# EAGLE design CARDUINO_32U4 (EAGLE 6.4)
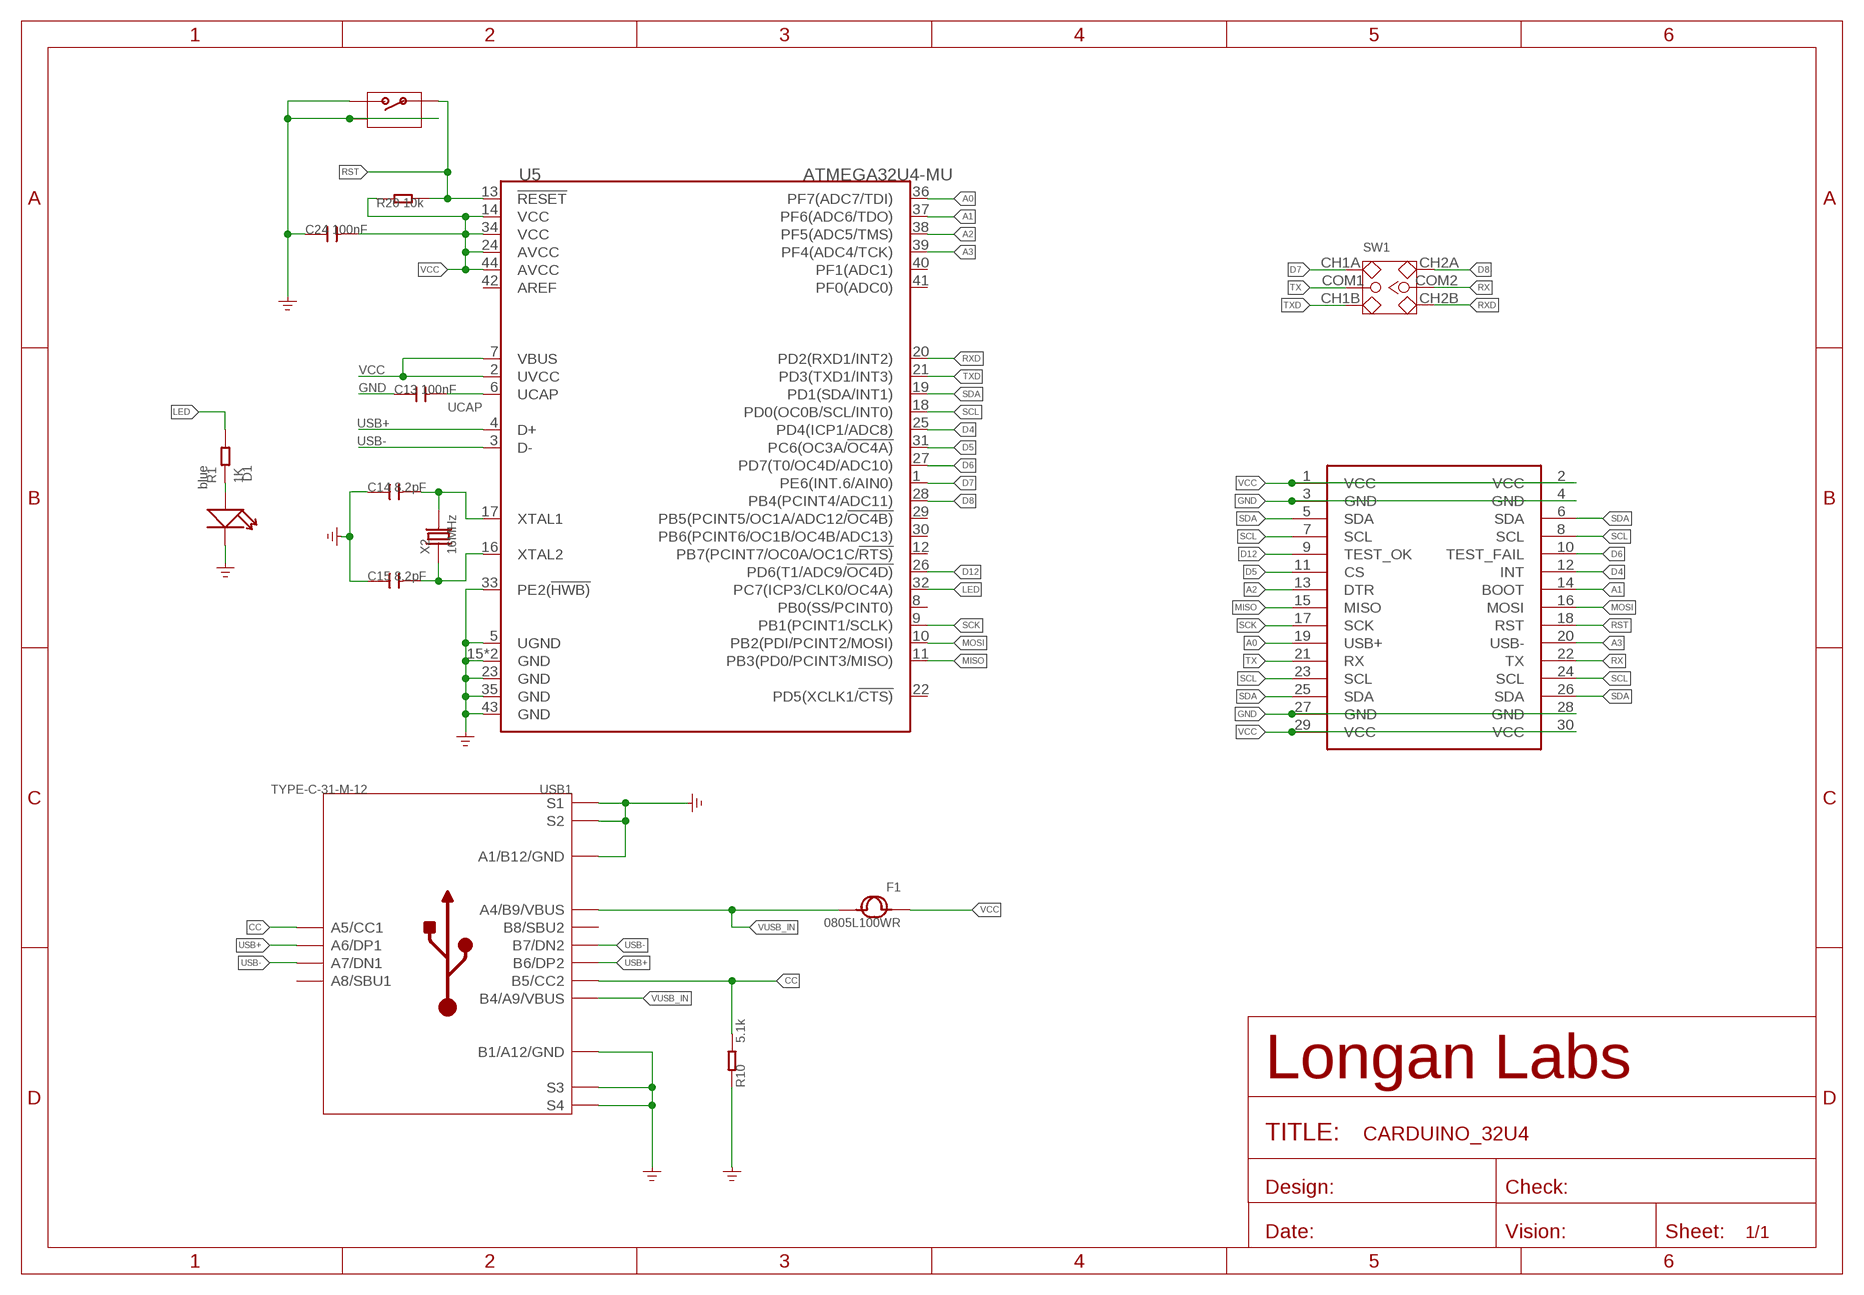
[diagram p0: schematic, sheet 1]

## Parts
C13  100nF  C-0603  [C0603]
C14  8.2pF  C-0603  [C0603]
C15  8.2pF  C-0603  [C0603]
C24  100nF  C-0603  [C0603]
D1  blue  LED'0603'  [LED-0603]
F1  0805L100WR  FUSE0805  [F0805]
MOUDLE1  MOUDLE-2X15P-2.54'BOARD'  [MOUDLE-2X15P-2.54]
R1  1K  RES-0603  [R0603]
R10  5.1k  RES-0603  [R0603]
R20  10k  R-0603  [R0603]
RESET  BUTTON-4P-REINFORCE  BUTTON-4P-REINFORCE'TS-1188E'  [4P-SMD-7X3.5X3.5H]
SW1  SWITCH-2CH-6P  [SW6-2.5-SMD-9.2X3.5X3.5MM]
U5  ATMEGA32U4-MU  [QFN44]
USB1  TYPE-C-31-M-12  USB2.0-TYPE-C  [USB2.0-TYPE-C]
X2  16MHz  CRYSTAL'5032'  [2P-SMD-5X3.2]

## Nets
A0: MOUDLE1.19(USB+) U5.36(PF7(ADC7/TDI))
A1: MOUDLE1.14(BOOT) U5.37(PF6(ADC6/TDO))
A2: MOUDLE1.13(DTR) U5.38(PF5(ADC5/TMS))
A3: MOUDLE1.20(USB-) U5.39(PF4(ADC4/TCK))
CC: R10.2 USB1.A5(A5/CC1) USB1.B5(B5/CC2)
D4: MOUDLE1.12(INT) U5.25(PD4(ICP1/ADC8))
D5: MOUDLE1.11(CS) U5.31(PC6(OC3A/!OC4A))
D6: MOUDLE1.10(TEST_FAIL) U5.27(PD7(T0/OC4D/ADC10))
D7: SW1.CH1A U5.1(PE6(INT.6/AIN0))
D8: SW1.CH2A U5.28(PB4(PCINT4/ADC11))
D12: MOUDLE1.9(TEST_OK) U5.26(PD6(T1/ADC9/!OC4D))
GND [none1]: C13.1 C14.1 C15.1 C24.1 D1.- MOUDLE1.3(GND) MOUDLE1.4(GND) MOUDLE1.27(GND) MOUDLE1.28(GND) R10.1 RESET.2 RESET.S1 RESET.S2 U5.5(UGND) U5.15(GND) U5.23(GND) U5.33(PE2(!HWB)) U5.35(GND) U5.43(GND) U5.TAB(GND) USB1.A1_B12(A1/B12/GND) USB1.B1_A12(B1/A12/GND) USB1.S1 USB1.S2 USB1.S3 USB1.S4 USB1.S5(S1) USB1.S6(S2)
LED: R1.2 U5.32(PC7(ICP3/CLK0/OC4A))
MISO: MOUDLE1.15(MISO) U5.11(PB3(PD0/PCINT3/MISO))
MOSI: MOUDLE1.16(MOSI) U5.10(PB2(PDI/PCINT2/MOSI))
N$1: D1.+ R1.1
N$6: C14.2 U5.17(XTAL1) X2.2
N$12: C15.2 U5.16(XTAL2) X2.1
RST: MOUDLE1.18(RST) R20.2 RESET.1 U5.13(!RESET)
RX: MOUDLE1.22(TX) SW1.COM2
RXD: SW1.CH2B U5.20(PD2(RXD1/INT2))
SCK: MOUDLE1.17(SCK) U5.9(PB1(PCINT1/SCLK))
SCL: MOUDLE1.7(SCL) MOUDLE1.8(SCL) MOUDLE1.23(SCL) MOUDLE1.24(SCL) U5.18(PD0(OC0B/SCL/INT0))
SDA: MOUDLE1.5(SDA) MOUDLE1.6(SDA) MOUDLE1.25(SDA) MOUDLE1.26(SDA) U5.19(PD1(SDA/INT1))
TX: MOUDLE1.21(RX) SW1.COM1
TXD: SW1.CH1B U5.21(PD3(TXD1/INT3))
UCAP: C13.2 U5.6(UCAP)
USB+: U5.4(D+) USB1.A6(A6/DP1) USB1.B6(B6/DP2)
USB-: U5.3(D-) USB1.A7(A7/DN1) USB1.B7(B7/DN2)
VCC: C24.2 F1.1 MOUDLE1.1(VCC) MOUDLE1.2(VCC) MOUDLE1.29(VCC) MOUDLE1.30(VCC) R20.1 U5.2(UVCC) U5.7(VBUS) U5.14(VCC) U5.24(AVCC) U5.34(VCC) U5.44(AVCC)
VUSB_IN: F1.2 USB1.A4_B9(A4/B9/VBUS) USB1.B4_A9(B4/A9/VBUS)
Unconnected: U5.8(PB0(SS/PCINT0)) U5.12(PB7(PCINT7/OC0A/OC1C/!RTS)) U5.22(PD5(XCLK1/!CTS)) U5.29(PB5(PCINT5/OC1A/ADC12/!OC4B)) U5.30(PB6(PCINT6/OC1B/OC4B/ADC13)) U5.40(PF1(ADC1)) U5.41(PF0(ADC0)) U5.42(AREF) USB1.A8(A8/SBU1) USB1.B8(B8/SBU2)

## Library data of the parts
C13-C15 C24 = Discrete:C*: Ceramic Capacitors
D1 = Discrete-new:LED
F1 = Discrete-small:FUSE
MOUDLE1 = Longan-moudle:MOUDLE-2X15P-2.54
R1 R10 = Discrete-new:RES
R20 = Discrete:R*
RESET = Discrete:BUTTON-4P-REINFORCE: TS-1188E http://www.best-dz.com/?thread-374-2.html
SW1 = LONGAN-DISCRETE:SWITCH-2CH-6P
U5 = IC:ATMEGA32U4: 8-bit Microcontroller With 16/32K Bytes of ISP Flash and USB controller
USB1 = Connector-new:USB2.0-TYPE-C
X2 = Discrete:CRYSTAL*: CRYSTAL

## Board
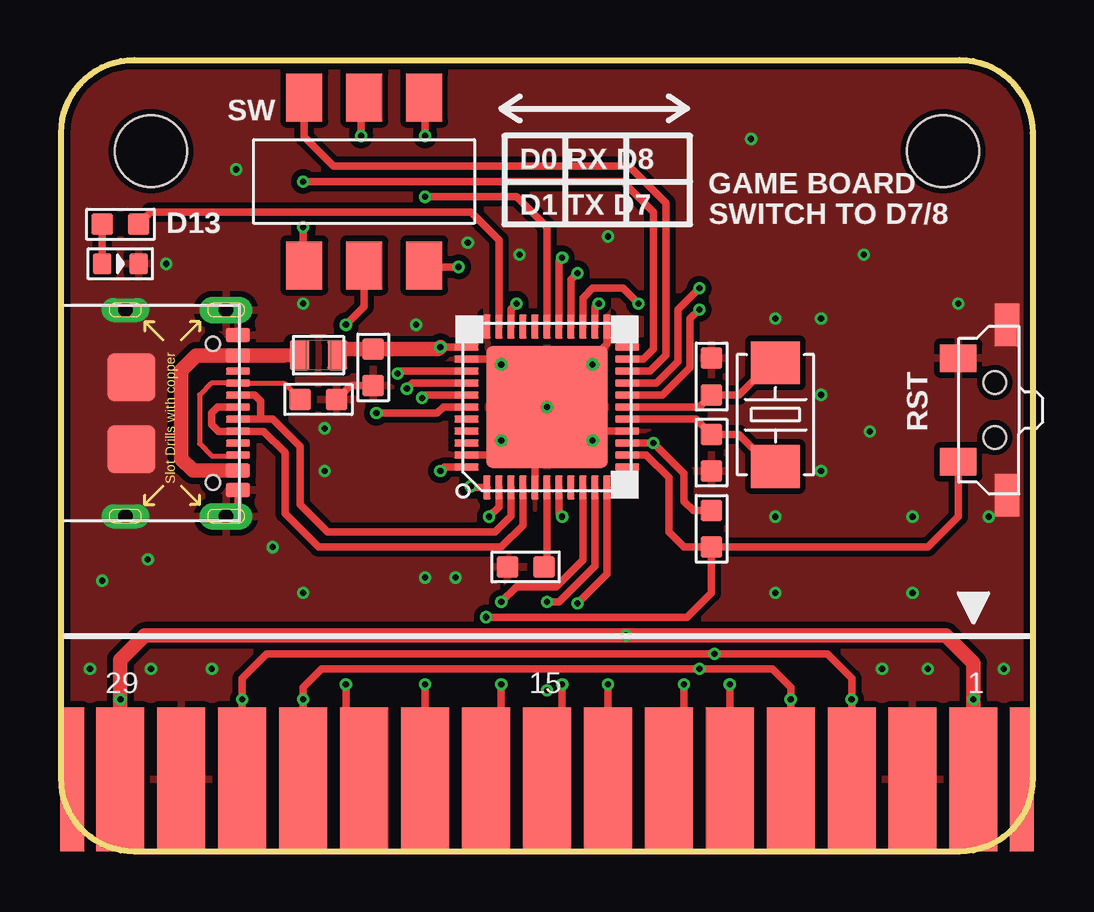
[diagram p1: board, top side]
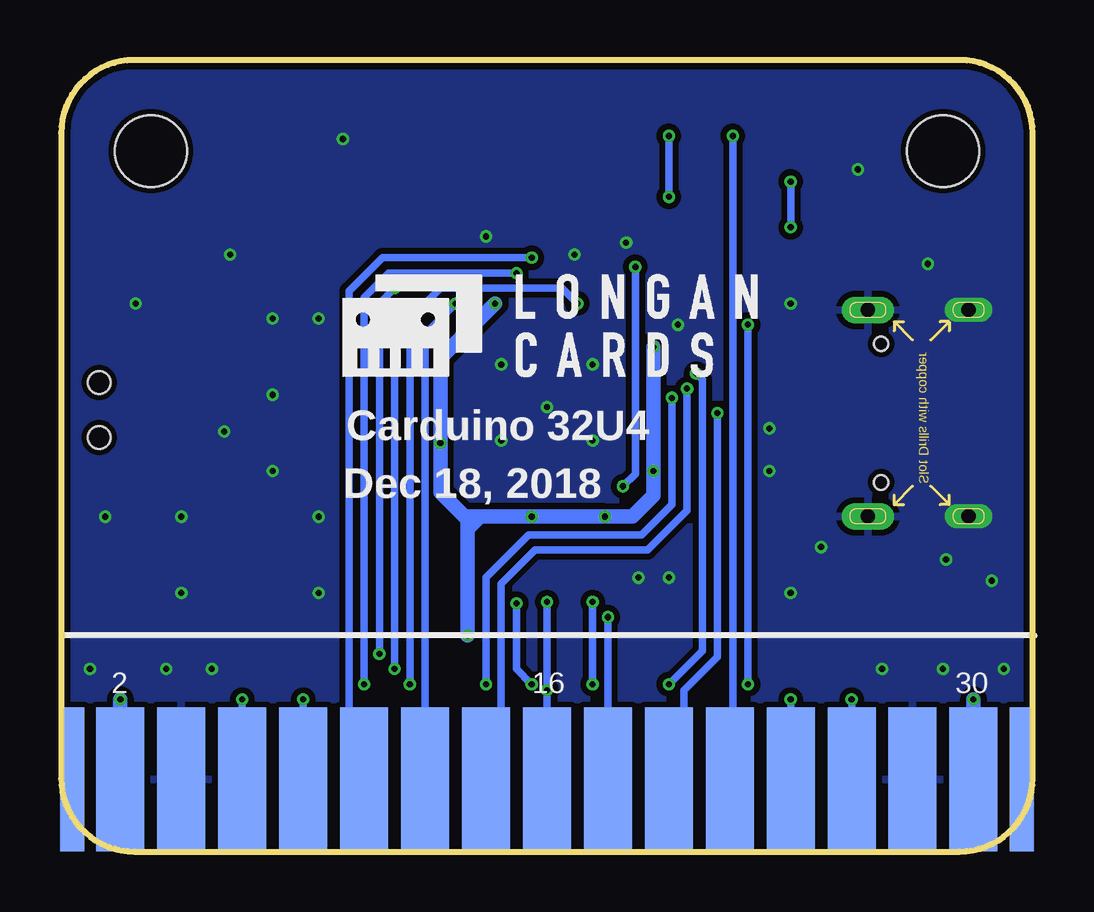
[diagram p2: board, bottom side, seen from below]

Size 40.5 x 33 mm. Coordinates in mm from the lower left corner, seen from the top.
Copper layers (1*16): Top 0.035mm / dielectric 1.5mm / Bottom 0.035mm
Design rules "SeeedStudio_2layer_DRU_no_angle_20140221": minimum track width 1mil, minimum drill 10mil, track to track 6mil, track to pad 6mil, pad to pad 6mil, via to via 6mil, smd to smd 0mil, copper to edge 10mil, drill to drill 10mil, minimum pad ring 4mil, minimum via ring 4mil, stop-mask expansion 2mil, vias tented up to drill 25mil, thermal gap 10mil

### Footprints (pad centres in the part's own frame; a part is rotated, then mirrored left to right if it is on the bottom)
C0603 = smd 0.889 x 0.889: 1 -0.762,0; 2 0.762,0
LED-0603 = smd 0.762 x 0.889: + -0.762,0; - 0.762,0
F0805 = smd 0.819 x 1.27: 1 -0.79,0; 2 0.79,0
MOUDLE-2X15P-2.54 = smd 2 x 6: 1 17.78,-13.492; 3 15.24,-13.492; 5 12.7,-13.492; 7 10.16,-13.492; 9 7.62,-13.492; 11 5.08,-13.492; 13 2.54,-13.492; 15 0,-13.492; 17 -2.54,-13.492; 19 -5.08,-13.492; 21 -7.62,-13.492; 23 -10.16,-13.492; 25 -12.7,-13.492; 27 -15.24,-13.492; 29 -17.78,-13.492 | smd 2 x 6 bottom: 2 17.78,-13.492; 4 15.24,-13.492; 6 12.7,-13.492; 8 10.16,-13.492; 10 7.62,-13.492; 12 5.08,-13.492; 14 2.54,-13.492; 16 0,-13.492; 18 -2.54,-13.492; 20 -5.08,-13.492; 22 -7.62,-13.492; 24 -10.16,-13.492; 26 -12.7,-13.492; 28 -15.24,-13.492; 30 -17.78,-13.492 | smd 1 x 6: P1 -19.8,-13.492; P4 19.8,-13.492 | smd 1 x 6 bottom: P2 -19.8,-13.492; P3 19.8,-13.492 | hole 3: -16.51,12.7; 16.51,12.7
R0603 = smd 0.889 x 0.889: 1 0,0.762; 2 0,-0.762
R0603' = smd 0.889 x 0.889: 1 -0.762,0; 2 0.762,0
4P-SMD-7X3.5X3.5H = smd 1.143 x 1.524: 1 -2.159,1.524; 2 2.159,1.524 | smd 1.778 x 1.016: S1 -3.556,-0.508; S2 3.556,-0.508 | hole 0.95: -1.15,0; 1.15,0
SW6-2.5-SMD-9.2X3.5X3.5MM = smd 1.5 x 2: CH1A -2.5,3.5; CH1B 2.5,3.5; CH2A -2.5,-3.5; CH2B 2.5,-3.5; COM1 0,3.5; COM2 0,-3.5
QFN44 = smd 1 x 0.3: 1 -3.35,2.5; 2 -3.35,2; 3 -3.35,1.5; 4 -3.35,1; 5 -3.35,0.5; 6 -3.35,0; 7 -3.35,-0.5; 8 -3.35,-1; 9 -3.35,-1.5; 10 -3.35,-2; 11 -3.35,-2.5; 23 3.35,-2.5; 24 3.35,-2; 25 3.35,-1.5; 26 3.35,-1; 27 3.35,-0.5; 28 3.35,0; 29 3.35,0.5; 30 3.35,1; 31 3.35,1.5; 32 3.35,2; 33 3.35,2.5 | smd 0.3 x 1: 12 -2.5,-3.35; 13 -2,-3.35; 14 -1.5,-3.35; 15 -1,-3.35; 16 -0.5,-3.35; 17 0,-3.35; 18 0.5,-3.35; 19 1,-3.35; 20 1.5,-3.35; 21 2,-3.35; 22 2.5,-3.35; 34 2.5,3.35; 35 2,3.35; 36 1.5,3.35; 37 1,3.35; 38 0.5,3.35; 39 0,3.35; 40 -0.5,3.35; 41 -1,3.35; 42 -1.5,3.35; 43 -2,3.35; 44 -2.5,3.35 | smd 5.08 x 5.08: TAB 0,0
USB2.0-TYPE-C = smd 1 x 0.6: A1_B12 -0.05,3.25; A4_B9 -0.05,2.4; B1_A12 -0.05,-3.2; B4_A9 -0.05,-2.4 | smd 1 x 0.3: A5 -0.05,1.25; A6 -0.05,0.25; A7 -0.05,-0.25; A8 -0.05,-1.25; B5 -0.05,-1.75; B6 -0.05,-0.75; B7 -0.05,0.75; B8 -0.05,1.75 | drill 0.6 pad 1 long: S1 -4.75,4.3; S2 -4.75,-4.3 | drill 0.6 pad 1.1 long: S3 -0.55,4.3; S4 -0.55,-4.3 | smd 2 x 2: S5 -4.5,1.5; S6 -4.5,-1.5 | hole 0.6: -1.1,-2.89; -1.1,2.89
2P-SMD-5X3.2 = smd 1.778 x 2.032: 1 -2.159,0; 2 2.159,0

### Placement (x,y rotation side)
C13  19.36,11.86 0 top
C14  27.11,19.8 270 top
C15  27.11,16.63 90 top
C24  13.01,20.18 90 top
D1  2.47,24.5 0 top
F1  10.72,20.69 180 top
MOUDLE1  20.25,16.5 0 top
R1  2.47,26.15 90 top
R10  10.72,18.85 270 top
R20  10k  [R0603']  27.11,13.45 270 top
RESET  38.92,18.41 90 top
SW1  12.63,27.93 180 top
U5  20.25,18.53 90 top
U$6  [LONGAN-CARDS-MIDDLE]  29.52,19.29 0 bottom
USB1  7.42,18.28 0 top
X2  29.77,18.21 90 top

### Tracks (layer width: path | path; a pad name or v marks a point on that pad's centre or on a via)
A0  (via drill 0.25 pad 0.51)
  Top 0.305: v15.17,6.97 MOUDLE1.19 | U5.36 14.18,20.03 v14.03,19.93
  Bottom 0.305: v15.17,6.97 13.77,8.37 13.77,19.68 v14.03,19.93
A1  (via drill 0.25 pad 0.51)
  Top 0.305: U5.37 14.65,19.53 v14.41,19.29
  Bottom 0.305: MOUDLE1.14 22.79,4.44 22.16,5.07 22.16,11.17 20.76,12.56 16.06,12.56 14.41,14.21 v14.41,19.29
A2  (via drill 0.25 pad 0.51)
  Top 0.305: U5.38 15.16,19.03 v15.04,18.91 | v22.79,6.97 MOUDLE1.13 22.79,2.4
  Bottom 0.305: v15.04,18.91 15.04,14.47 16.31,13.2 21.01,13.2 22.79,11.42 v22.79,6.97
A3  (via drill 0.25 pad 0.51)
  Top 0.305: U5.39 15.93,18.53 15.68,18.28 v13.14,18.28
  Bottom 0.305: MOUDLE1.20 14.54,3.64 14.54,6.72 13.14,8.12 v13.14,18.28
CC
  Top 0.203: USB1.B5 7.35,16.5 6.28,16.5 5.77,17.01 5.77,19.04 6.26,19.53 USB1.A5 9.28,19.53 R10.2
D4  (via drill 0.25 pad 0.51)
  Top 0.305: U5.25 21.75,23.08 22.16,23.48 23.43,23.48 v24.06,22.85
  Bottom 0.305: MOUDLE1.12 25.33,21.58 v24.06,22.85
D5  (via drill 0.25 pad 0.51)
  Top 0.305: MOUDLE1.11 25.33,3.55 25.96,4.18 v25.96,6.97 | U5.31 18.75,22.62 v18.98,22.85
  Bottom 0.305: v25.96,6.97 25.96,22.21 24.7,23.48 19.61,23.48 v18.98,22.85
D6  (via drill 0.25 pad 0.51)
  Top 0.305: U5.27 20.75,24.62 v20.89,24.76
  Bottom 0.305: MOUDLE1.10 28.51,3.64 28.51,23.36 27.11,24.76 v20.89,24.76
D7  (via drill 0.25 pad 0.51)
  Top 0.305: U5.1 17.12,15.18 v17.07,15.23 | v16.57,24.37 15.19,24.37 SW1.CH1A
  Bottom 0.305: v17.07,15.23 16.57,15.74 v16.57,24.37
D8  (via drill 0.25 pad 0.51)
  Top 0.305: U5.28 20.25,26.02 18.98,27.3 v15.17,27.3 | v15.17,29.84 15.17,31.39 SW1.CH2A
  Bottom 0.305: v15.17,27.3 v15.17,29.84
D12  (via drill 0.25 pad 0.51)
  Top 0.305: MOUDLE1.9 27.87,5.07 | 27.87,5.07 27.23,5.71 | v27.87,6.97 27.87,5.07 | U5.26 21.25,23.85 v21.52,24.12
  Bottom 0.305: v27.87,6.97 27.87,23.1 26.85,24.12 22.54,24.12 v21.52,24.12
GND  (via drill 0.25 pad 0.51)
  Top 0.305: U5.15 21.25,17.53 U5.TAB | U5.5 19.75,16.88 | 19.75,16.88 19.75,18.03 U5.TAB | U5.43 19.4,16.53 19.75,16.88 | U5.35 18.25,20.53 U5.TAB | U5.23 22.75,21.16 22.41,20.82 22.41,20.69 U5.TAB | USB1.B1_A12 7.37,14.48 USB1.S4 | C24.1 12.06,19.42 R10.1
  other vias: 20.25,18.53 3.74,7.61 6.28,7.61 1.2,7.61 34.22,7.61 36.12,7.61 39.3,7.61 29.77,13.96 31.68,15.87 31.68,19.04 31.68,22.21 29.77,22.21 33.71,17.52 35.49,13.96 29.77,10.79 35.49,10.79 37.39,22.85 18.34,20.31 22.16,20.31 22.16,17.14 18.34,17.14 4.38,24.5 14.79,21.96 7.3,28.44 3.61,12.18 8.82,12.69 10.09,10.79 16.44,11.42 15.17,11.42 1.71,11.29 33.46,24.88 38.66,13.96 10.09,22.85 10.98,15.87 16.95,25.39 10.98,17.64 28.76,29.71 19.11,24.88 22.79,25.64
  pour Top (isolate 0.254): -0.2,33.01 40.57,33.01 40.57,-0.01 -0.2,-0.01
  pour Bottom (isolate 0.254): -0.2,33.01 40.57,33.01 40.57,-0.01 -0.2,-0.01
LED
  Top 0.305: U5.32 18.25,25.48 17.07,26.66 3.74,26.66 R1.2
MISO  (via drill 0.25 pad 0.51)
  Top 0.305: MOUDLE1.15 20.89,3.64 v20.89,6.97 | U5.11 22.75,11.57 v21.52,10.34
  Bottom 0.305: v21.52,10.34 21.52,7.61 v20.89,6.97
MOSI  (via drill 0.25 pad 0.51)
  Top 0.305: U5.10 22.25,11.9 20.76,10.4 v20.25,10.4
  Bottom 0.305: MOUDLE1.16 v20.25,6.72 v20.25,10.4
N$1
  Top 0.305: D1.+ R1.1
N$6
  Top 0.305: U5.17 26.6,18.53 C14.2 28.25,19.04 29.27,20.06 29.46,20.06 X2.2
N$12
  Top 0.305: U5.16 26.46,18.03 C15.2 28.25,17.39 29.14,16.5 29.33,16.5 X2.1
RST  (via drill 0.25 pad 0.51)
  Top 0.305: 37.01,15.87 RESET.1 37.39,13.96 36.12,12.69 R20.2 | U5.13 24.39,16.53 25.33,15.59 25.33,13.32 25.96,12.69 R20.2 | v17.71,9.77 26.09,9.77 27.11,10.79 R20.2
  Bottom 0.305: MOUDLE1.18 v17.71,9.77
RX  (via drill 0.25 pad 0.51)
  Top 0.305: v12.5,29.84 12.5,31.3 SW1.COM2
  Bottom 0.305: MOUDLE1.22 12.63,5.45 12.5,5.58 v12.5,29.84
RXD
  Top 0.305: U5.20 24.54,20.03 25.2,20.69 25.2,27.04 23.68,28.56 11.36,28.56 10.13,29.8 SW1.CH2B
SCK  (via drill 0.25 pad 0.51)
  Top 0.305: U5.9 21.75,12.16 20.63,11.04 18.98,11.04 v18.34,10.4 | v18.34,6.97 18.34,3.64 MOUDLE1.17
  Bottom 0.305: v18.34,10.4 v18.34,6.97
SCL  (via drill 0.25 pad 0.51)
  Top 0.305: MOUDLE1.7 v30.41,6.34 30.41,6.85 29.65,7.61 v26.6,7.61 10.85,7.61 10.09,6.85 v10.09,6.34 MOUDLE1.24 | U5.18 25.07,19.03 26.22,20.18 26.22,22.21 v26.6,22.6
  Bottom 0.305: v10.09,6.34 MOUDLE1.24 | v30.41,6.34 MOUDLE1.7 | v26.6,7.61 v26.6,22.6
SDA  (via drill 0.25 pad 0.51)
  Top 0.305: MOUDLE1.26 v7.55,6.34 7.55,7.23 8.57,8.24 v27.23,8.24 31.93,8.24 32.95,7.23 v32.95,6.34 MOUDLE1.5 | U5.19 24.81,19.53 25.71,20.44 25.71,22.6 v26.6,23.48
  Bottom 0.305: MOUDLE1.26 v7.55,6.34 | v32.95,6.34 MOUDLE1.5 | v27.23,8.24 27.23,22.85 v26.6,23.48
TX  (via drill 0.25 pad 0.51)
  Top 0.305: MOUDLE1.21 12.63,5.07 11.99,5.71 11.87,5.71 v11.87,6.97 | v11.87,21.96 12.63,22.72 SW1.COM1
  Bottom 0.305: v11.87,6.97 v11.87,21.96
TXD  (via drill 0.25 pad 0.51)
  Top 0.305: U5.21 24.28,20.53 24.7,20.95 24.7,26.66 23.43,27.93 v10.09,27.93 | v10.09,26.02 10.09,24.47 SW1.CH1B
  Bottom 0.305: v10.09,27.93 v10.09,26.02
UCAP
  Top 0.305: U5.6 20.25,12.05 C13.2
USB+
  Top 0.305: U5.4 19.25,13.6 18.34,12.69 10.72,12.69 9.33,14.09 9.33,16.63 8.44,17.52 7.38,17.52 USB1.B6 7.36,17.52 6.56,17.52 6.28,17.8 6.28,18.28 6.53,18.53 USB1.A6
USB-
  Top 0.305: U5.3 18.75,13.98 18.09,13.32 11.11,13.32 9.96,14.47 9.96,16.88 8.82,18.02 8.31,18.02 | 8.31,18.02 USB1.A7 | USB1.B7 8.07,19.03 8.31,18.79 8.31,18.02
VCC  (via drill 0.25 pad 0.51)
  Top 0.305: U5.2 18.25,14.37 v17.84,13.96 | v24.7,17.03 24.8,17.03 | U5.34 v15.8,21.03 | U5.7 20.75,14.1 v20.89,13.96 | 14.07,21.03 C24.2 | U5.44 15.97,16.03 v15.8,15.87 | v24.7,17.03 U5.14 | U5.24 22.25,22.69 v22.41,22.85 | v24.7,17.03 25.96,15.76 25.96,14.6 26.35,14.21 R20.1
  Top 0.61: v15.8,21.03 15.72,20.95 C24.2 11.52,20.95 F1.1 | MOUDLE1.2 v38.03,6.34 38.03,7.86 36.89,9.01 v23.55,9.01 3.49,9.01 2.47,7.99 v2.47,6.34 MOUDLE1.30
  Bottom 0.61: v15.8,21.03 v15.8,15.87 15.8,14.85 16.69,13.96 v17.84,13.96 v20.89,13.96 23.04,13.96 | 23.04,13.96 23.55,13.96 | 23.55,13.96 23.68,13.96 24.7,14.98 v24.7,17.03 24.7,20.56 v22.41,22.85 | v38.03,6.34 MOUDLE1.2 | MOUDLE1.30 v2.47,6.34 | 23.55,13.96 23.55,13.45 | 23.55,13.45 23.04,13.96 | 23.55,13.45 v23.55,9.01
VUSB_IN
  Top 0.61: USB1.B4_A9 5.51,15.88 5.01,16.37 5.01,20.06 5.63,20.68 USB1.A4_B9 9.29,20.68 F1.2

### Text on the board
tPlace: SW | D0 RX D8 | GAME BOARD | D1 TX D7 | SWITCH TO D7/8 | D13 | RST
bPlace: Carduino 32U4 | Dec 18, 2018